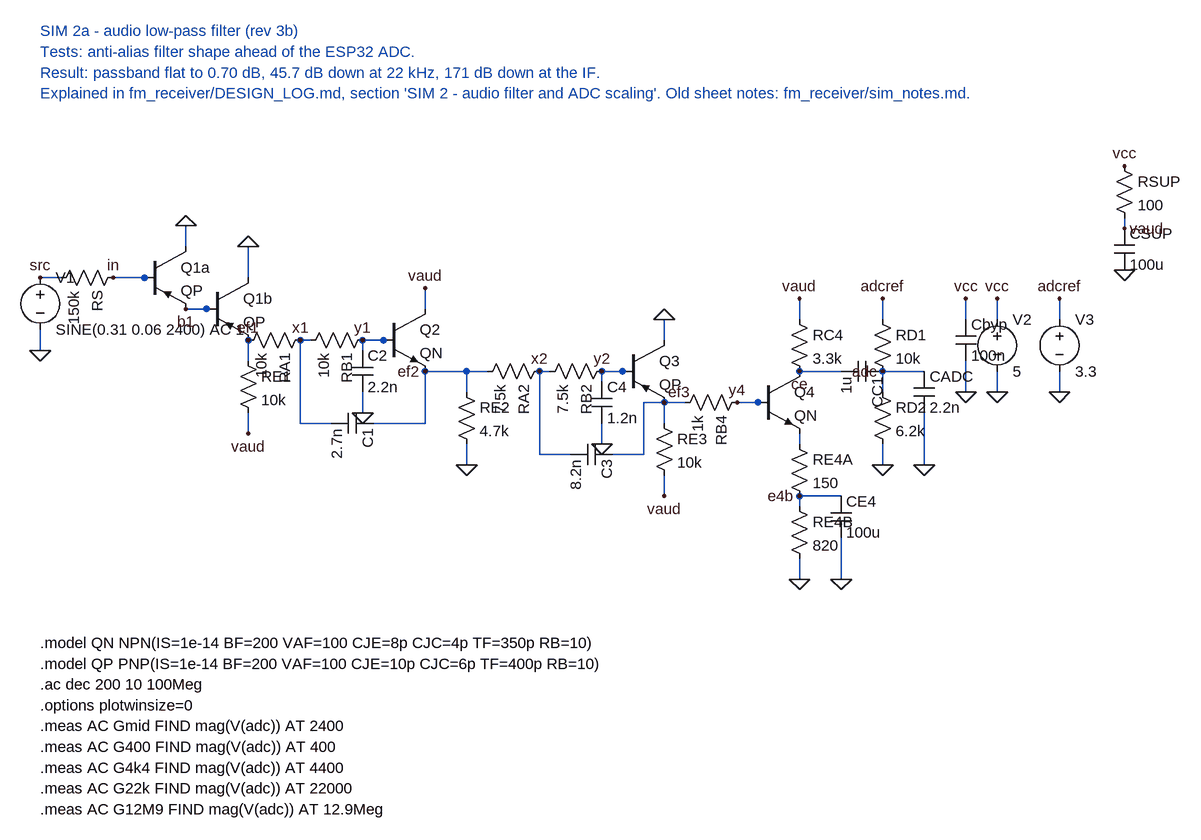
[diagram p0: schematic sim2a_audio_freq.asc]
sim2a_audio_freq.asc, the LTspice schematic file:
Version 4
SHEET 1 1800 1000
WIRE 48 288 80 288
WIRE 48 368 48 400
WIRE 160 288 224 288
WIRE 272 240 272 208
WIRE 272 336 320 336
WIRE 368 288 368 240
WIRE 368 384 368 416
WIRE 368 496 368 528
WIRE 448 384 464 384
WIRE 544 384 544 400
WIRE 544 464 544 496
WIRE 544 384 592 384
WIRE 640 336 640 304
WIRE 640 432 704 432
WIRE 704 432 704 464
WIRE 704 544 704 576
WIRE 448 384 448 512
WIRE 448 512 496 512
WIRE 560 512 640 512
WIRE 640 512 640 432
WIRE 704 432 736 432
WIRE 816 432 832 432
WIRE 912 432 912 448
WIRE 912 512 912 544
WIRE 912 432 960 432
WIRE 1008 384 1008 352
WIRE 1008 480 1008 512
WIRE 1008 592 1008 624
WIRE 816 432 816 560
WIRE 816 560 864 560
WIRE 928 560 976 560
WIRE 976 560 976 480
WIRE 976 480 1008 480
WIRE 1008 480 1040 480
WIRE 1120 480 1168 480
WIRE 1216 352 1216 320
WIRE 1216 528 1216 544
WIRE 1216 624 1216 640
WIRE 1216 720 1216 752
WIRE 1216 624 1280 624
WIRE 1280 688 1280 752
WIRE 1216 432 1280 432
WIRE 1344 352 1344 320
WIRE 1344 432 1344 464
WIRE 1344 544 1344 576
WIRE 1344 432 1408 432
WIRE 1408 496 1408 576
WIRE 1472 352 1472 320
WIRE 1472 416 1472 464
WIRE 1520 352 1520 320
WIRE 1520 432 1520 464
WIRE 1616 352 1616 320
WIRE 1616 432 1616 464
FLAG 48 400 0
FLAG 48 288 src
FLAG 160 288 in
FLAG 272 208 0
FLAG 272 336 b1
FLAG 368 240 0
FLAG 368 384 ef1
FLAG 368 528 vaud
FLAG 448 384 x1
FLAG 544 384 y1
FLAG 544 496 0
FLAG 640 304 vaud
FLAG 640 432 ef2
FLAG 704 576 0
FLAG 816 432 x2
FLAG 912 432 y2
FLAG 912 544 0
FLAG 1008 352 0
FLAG 1008 480 ef3
FLAG 1008 624 vaud
FLAG 1120 480 y4
FLAG 1216 320 vaud
FLAG 1216 432 ce
FLAG 1216 624 e4b
FLAG 1216 752 0
FLAG 1280 752 0
FLAG 1344 320 adcref
FLAG 1344 432 adc
FLAG 1344 576 0
FLAG 1408 576 0
FLAG 1472 320 vcc
FLAG 1472 464 0
FLAG 1520 320 vcc
FLAG 1520 464 0
FLAG 1616 320 adcref
FLAG 1616 464 0
SYMBOL voltage 48 272 R0
SYMATTR InstName V1
SYMATTR Value SINE(0.31 0.06 2400) AC 1
SYMBOL res 176 272 R90
SYMATTR InstName RS
SYMATTR Value 150k
SYMBOL pnp 208 240 R0
SYMATTR InstName Q1a
SYMATTR Value QP
SYMBOL pnp 304 288 R0
SYMATTR InstName Q1b
SYMATTR Value QP
SYMBOL res 352 400 R0
SYMATTR InstName RE1
SYMATTR Value 10k
SYMBOL res 464 368 R90
SYMATTR InstName RA1
SYMATTR Value 10k
SYMBOL res 560 368 R90
SYMATTR InstName RB1
SYMATTR Value 10k
SYMBOL cap 528 400 R0
SYMATTR InstName C2
SYMATTR Value 2.2n
SYMBOL npn 576 336 R0
SYMATTR InstName Q2
SYMATTR Value QN
SYMBOL res 688 448 R0
SYMATTR InstName RE2
SYMATTR Value 4.7k
SYMBOL cap 560 496 R90
SYMATTR InstName C1
SYMATTR Value 2.7n
SYMBOL res 832 416 R90
SYMATTR InstName RA2
SYMATTR Value 7.5k
SYMBOL res 928 416 R90
SYMATTR InstName RB2
SYMATTR Value 7.5k
SYMBOL cap 896 448 R0
SYMATTR InstName C4
SYMATTR Value 1.2n
SYMBOL pnp 944 384 R0
SYMATTR InstName Q3
SYMATTR Value QP
SYMBOL res 992 496 R0
SYMATTR InstName RE3
SYMATTR Value 10k
SYMBOL cap 928 544 R90
SYMATTR InstName C3
SYMATTR Value 8.2n
SYMBOL res 1136 464 R90
SYMATTR InstName RB4
SYMATTR Value 1k
SYMBOL npn 1152 432 R0
SYMATTR InstName Q4
SYMATTR Value QN
SYMBOL res 1200 336 R0
SYMATTR InstName RC4
SYMATTR Value 3.3k
SYMBOL res 1200 528 R0
SYMATTR InstName RE4A
SYMATTR Value 150
SYMBOL res 1200 624 R0
SYMATTR InstName RE4B
SYMATTR Value 820
SYMBOL cap 1264 624 R0
SYMATTR InstName CE4
SYMATTR Value 100u
SYMBOL cap 1344 416 R90
SYMATTR InstName CC1
SYMATTR Value 1u
SYMBOL res 1328 336 R0
SYMATTR InstName RD1
SYMATTR Value 10k
SYMBOL res 1328 448 R0
SYMATTR InstName RD2
SYMATTR Value 6.2k
SYMBOL cap 1392 432 R0
SYMATTR InstName CADC
SYMATTR Value 2.2n
SYMBOL cap 1456 352 R0
SYMATTR InstName Cbyp
SYMATTR Value 100n
SYMBOL voltage 1520 336 R0
SYMATTR InstName V2
SYMATTR Value 5
SYMBOL voltage 1616 336 R0
SYMATTR InstName V3
SYMATTR Value 3.3
SYMBOL res 1700 100 R0
SYMATTR InstName RSUP
SYMATTR Value 100
SYMBOL cap 1700 212 R0
SYMATTR InstName CSUP
SYMATTR Value 100u
WIRE 1716 196 1716 212
FLAG 1716 116 vcc
FLAG 1716 212 vaud
FLAG 1716 276 0
TEXT 48 850 Left 2 !.model QN NPN(IS=1e-14 BF=200 VAF=100 CJE=8p CJC=4p TF=350p RB=10)
TEXT 48 882 Left 2 !.model QP PNP(IS=1e-14 BF=200 VAF=100 CJE=10p CJC=6p TF=400p RB=10)
TEXT 48 914 Left 2 !.ac dec 200 10 100Meg
TEXT 48 946 Left 2 !.options plotwinsize=0
TEXT 48 978 Left 2 !.meas AC Gmid FIND mag(V(adc)) AT 2400
TEXT 48 1010 Left 2 !.meas AC G400 FIND mag(V(adc)) AT 400
TEXT 48 1042 Left 2 !.meas AC G4k4 FIND mag(V(adc)) AT 4400
TEXT 48 1074 Left 2 !.meas AC G22k FIND mag(V(adc)) AT 22000
TEXT 48 1106 Left 2 !.meas AC G12M9 FIND mag(V(adc)) AT 12.9Meg
TEXT 48 -92 Left 2 ;SIM 2a - audio low-pass filter (rev 3b)
TEXT 48 -60 Left 2 ;Tests: anti-alias filter shape ahead of the ESP32 ADC.
TEXT 48 -28 Left 2 ;Result: passband flat to 0.70 dB, 45.7 dB down at 22 kHz, 171 dB down at the IF.
TEXT 48 4 Left 2 ;Explained in fm_receiver/DESIGN_LOG.md, section 'SIM 2 - audio filter and ADC scaling'. Old sheet notes: fm_receiver/sim_notes.md.

The netlist it stands for:
* sim2a_audio_freq.asc
V1 src 0 SINE(0.31 0.06 2400) AC 1
RS in src 150k
Q1a 0 in b1 0 QP
Q1b 0 b1 ef1 0 QP
RE1 ef1 vaud 10k
RA1 x1 ef1 10k
RB1 y1 x1 10k
C2 y1 0 2.2n
Q2 vaud y1 ef2 0 QN
RE2 ef2 0 4.7k
C1 ef2 x1 2.7n
RA2 x2 ef2 7.5k
RB2 y2 x2 7.5k
C4 y2 0 1.2n
Q3 0 y2 ef3 0 QP
RE3 ef3 vaud 10k
C3 ef3 x2 8.2n
RB4 y4 ef3 1k
Q4 ce y4 N001 0 QN
RC4 vaud ce 3.3k
RE4A N001 e4b 150
RE4B e4b 0 820
CE4 e4b 0 100u
CC1 adc ce 1u
RD1 adcref adc 10k
RD2 adc 0 6.2k
CADC adc 0 2.2n
Cbyp vcc 0 100n
V2 vcc 0 5
V3 adcref 0 3.3
RSUP vcc vaud 100
CSUP vaud 0 100u
.model NPN NPN
.model PNP PNP
.lib standard.bjt
.model QN NPN(IS=1e-14 BF=200 VAF=100 CJE=8p CJC=4p TF=350p RB=10)
.model QP PNP(IS=1e-14 BF=200 VAF=100 CJE=10p CJC=6p TF=400p RB=10)
.ac dec 200 10 100Meg
.options plotwinsize=0
.meas AC Gmid FIND mag(V(adc)) AT 2400
.meas AC G400 FIND mag(V(adc)) AT 400
.meas AC G4k4 FIND mag(V(adc)) AT 4400
.meas AC G22k FIND mag(V(adc)) AT 22000
.meas AC G12M9 FIND mag(V(adc)) AT 12.9Meg
* SIM 2a - audio low-pass filter (rev 3b)
* Tests: anti-alias filter shape ahead of the ESP32 ADC.
* Result: passband flat to 0.70 dB, 45.7 dB down at 22 kHz, 171 dB down at the IF.
* Explained in fm_receiver/DESIGN_LOG.md, section 'SIM 2 - audio filter and ADC scaling'. Old sheet notes: fm_receiver/sim_notes.md.
.backanno
.end